# Altium schematic sheet Current_DC.SchDoc: Current DC sense
size A3; Organization: ORGANIZATION; Address1: ADDRESS 1; Address2: ADDRESS 2; Address3: ADDRESS 3; Address4: ADDRESS 4; Revision: 0.0; SheetNumber: 16; SheetTotal: 19; ENG_APP_DATE: --/--/--; DSN_APP_DATE: --/--/--; CHK_APP_DATE: --/--/--
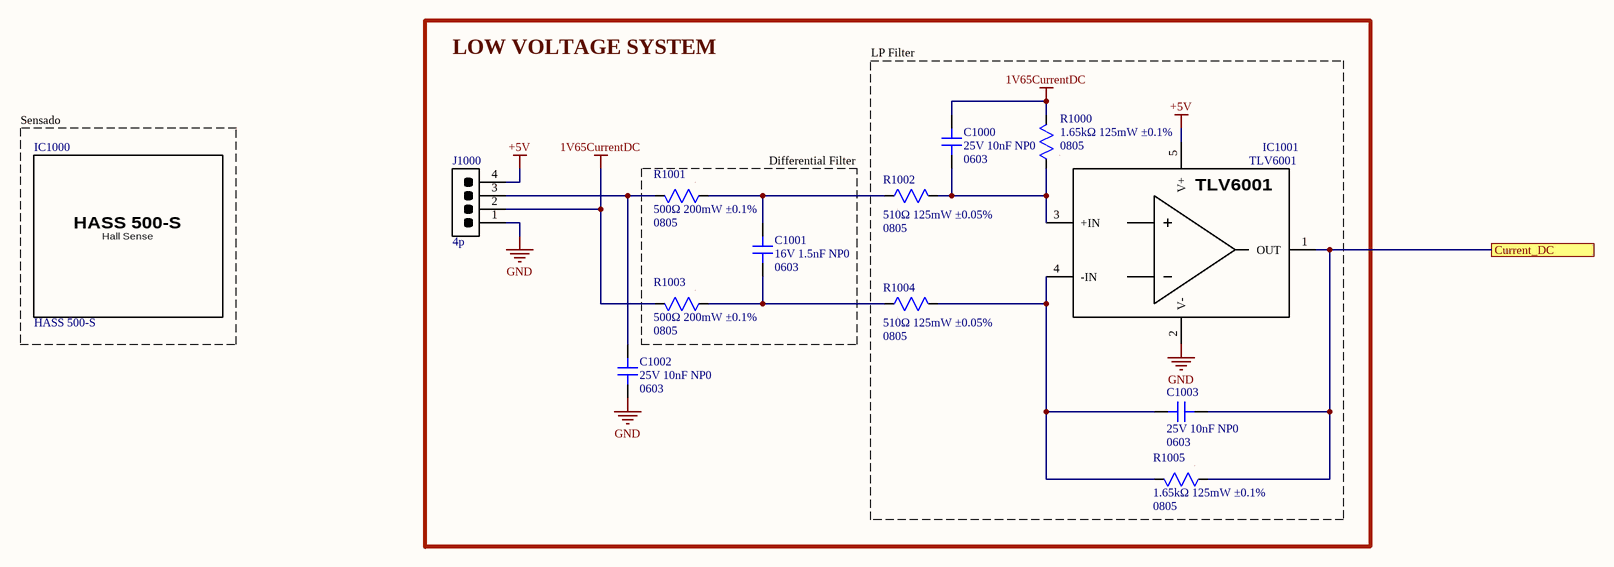
[diagram p0: Current_DC.SchDoc]

## Parts
C1000  value 25V 10nF NP0  Package: 0603  [CAP SMD 0603]  (hidden comment: CAP non polarized)
C1001  value 16V 1.5nF NP0  Package: 0603  [CAP SMD 0603]  (hidden comment: CAP non polarized)
C1002  value 25V 10nF NP0  Package: 0603  [CAP SMD 0603]  (hidden comment: CAP non polarized)
C1003  value 25V 10nF NP0  Package: 0603  [CAP SMD 0603]  (hidden comment: CAP non polarized)
IC1000  HASS 500-S  [HASS 500-S]
IC1001  TLV6001  [SOT-23-5]
J1000  value 4p  [B4B-XH-A-BK(LF)(SN)]  (hidden comment: CONN 4P)
R1000  value 1.65kΩ 125mW ±0.1%  Package: 0805  [RES SMD 0805]  (hidden comment: RES)
R1001  value 500Ω 200mW ±0.1%  Package: 0805  [RES SMD 0805]  (hidden comment: RES)
R1002  value 510Ω 125mW ±0.05%  Package: 0805  [RES SMD 0805]  (hidden comment: RES)
R1003  value 500Ω 200mW ±0.1%  Package: 0805  [RES SMD 0805]  (hidden comment: RES)
R1004  value 510Ω 125mW ±0.05%  Package: 0805  [RES SMD 0805]  (hidden comment: RES)
R1005  value 1.65kΩ 125mW ±0.1%  Package: 0805  [RES SMD 0805]  (hidden comment: RES)

## Blocks framed on the sheet
LOW VOLTAGE SYSTEM: C1002 J1000
LP Filter: C1000 C1003 IC1001 R1000 R1002 R1004 R1005
Sensado: IC1000
Differential Filter: C1001 R1001 R1003

## Ports
Current_DC

## Nets
1V65CurrentDC: C1000.1 J1000.2 R1000.2 R1003.2
+5V: IC1001.5(V+) J1000.4
GND: C1002.2 IC1001.2(V-) J1000.1
Current_DC: C1003.2 IC1001.1(OUT) R1005.1 ; port Current_DC
NetC1000_2: C1000.2 IC1001.3(+IN) R1000.1 R1002.2
NetC1001_1: C1001.1 R1001.1 R1002.1
NetC1001_2: C1001.2 R1003.1 R1004.1
NetC1002_1: C1002.1 J1000.3 R1001.2
NetC1003_1: C1003.1 IC1001.4(-IN) R1004.2 R1005.2

## Notes on the sheet
- Project:
- Subsystem:
- Company:
- Document:
- Author:
- Revision:
- Date:
- Sheet:
- /
- (in symbol 060-0003) Hall Sense

## Library data of the parts
C1000 C1002 C1003 = 001-0107: Condensadores de cerámica multicapa (MLCC- SMD/SMT) 0.01 uF 25 VDC 1% 0603 C0G (NP0) AEC-Q200; MPN: GRT1885C1E103FA02D; Manufacturer: muRata; ComponentLink1Description: Datasheet; ComponentLink1URL: https://www.mouser.es/datasheet/3/76/2/GRT1885C1E103FA02_01A.pdf; ComponentLink2Description: Distributor Link; ComponentLink2URL: https://www.mouser.es/ProductDetail/Murata-Electronics/GRT1885C1E103FA02D?qs=xZ%2FP%252Ba9zWqaqiXqJj78%252Bmg%3D%3D; ID: 001-0107; Distributor PN: 81-GRT1885C1E103FA2D; Distributor: Mouser
C1001 = 001-0121: Condensadores de cerámica multicapa (MLCC- SMD/SMT) 25V 1500pF C0G 0603 1%; MPN: C0603C152F3GECTU; Manufacturer: KEMET; ComponentLink1Description: Datasheet; ComponentLink1URL: https://www.mouser.es/datasheet/3/508/1/KEM_C1091_C0G_ESD.pdf; ComponentLink2Description: Distributor Link; ComponentLink2URL: https://www.mouser.es/ProductDetail/KEMET/C0603C152F3GECTU?qs=Mv7BduZupUh%252Bk5D8ZWarTg%3D%3D; ID: 001-0121; Distributor PN: 80-C0603C152F3GEC; Distributor: Mouser
IC1000 = 060-0003: Sensores de corriente montados en placa; Manufacturer: LEM; Value: 500A; ComponentLink1Description: Datasheet; ComponentLink1URL: https://www.lem.com/sites/default/files/products_datasheets/hass-50_600-s-v22.pdf; ComponentLink2Description: Distributor Link; ComponentLink2URL: https://www.mouser.es/ProductDetail/LEM/HASS-500-S?qs=Vi0JKjFBtYkICNHwIPcpdw%3D%3D; ID: 060-0003; Package: -; MPN: HASS 500-S; Distributor PN: 61-HASS500-S; Distributor: Mouser
IC1001 = 062-0002: Amplificadores operacionales - Op Amps Single 5.5-V 1-MHz R RIO operational a A A 595-TLV6001UIDBVT; MPN: TLV6001UIDBVR; Manufacturer: Texas Instruments; ID: 062-0002; Value: -; Package: SOT-23-5; Distributor PN: 595-TLV6001UIDBVR; Distributor: Mouser; ComponentLink1URL: https://www.ti.com/lit/ds/symlink/tlv6001.pdf?ts=1781607824916&ref_url=https%253A%252F%252Fcz.mouser.com%252F; ComponentLink2URL: https://www.mouser.es/ProductDetail/Texas-Instruments/TLV6001UIDBVR?qs=8N88piwwHEgntIgM8jjJ5Q%3D%3D
J1000 = 110-0068: Alojamientos de cables y cabecera XH HEADER (TOP); Manufacturer: JST; ComponentLink1Description: Datasheet; ComponentLink1URL: https://www.mouser.es/datasheet/3/1070/1/eXH.pdf; ComponentLink2Description: Distributor Link; ComponentLink2URL: https://www.mouser.es/ProductDetail/JST-Commercial/B4B-XH-A-BKLFSN?qs=cIziFXvMxOXLG2L7xSRqLw%3D%3D; ID: 110-0068; Package: THT 2,5mm; MPN: B4B-XH-A-BK(LF)(SN); Distributor PN: 306-B4BXHABKLFSN; Distributor: Mouser
R1000 R1005 = 010-0153: Thin Film Resistors MCU 0805-15 0.1% P1 1K65; MPN: MCU08050E1651BP100; Manufacturer: Vishay; ComponentLink1Description: Datasheet; ComponentLink1URL: https://www.vishay.com/docs/28700/mcx0x0xpre.pdf; ComponentLink2Description: Distributor Link; ComponentLink2URL: https://www.mouser.es/ProductDetail/Vishay-Beyschlag/MCU08050E1651BP100?qs=sGAEpiMZZMvdGkrng054t2c0lhweLxbk6HRvs42FTBI%3D; ID: 010-0153; Distributor PN: 594-MCU08050E1651BP1; Distributor: Mouser
R1001 R1003 = 010-0178: Resistores de película fina - SMD 0.2W 500ohm 0.1% 10ppm; MPN: PTN0805Y5000BST1; Manufacturer: Vishay; ComponentLink1Description: Datasheet; ComponentLink1URL: https://www.vishay.com/docs/60026/ptn.pdf; ComponentLink2Description: Distributor Link; ComponentLink2URL: https://www.mouser.es/ProductDetail/Vishay-Thin-Film/PTN0805Y5000BST1?qs=zW32dvEIR3sKd%2FnwncGe3A%3D%3D; ID: 010-0178; Distributor PN: 71-PTN0805Y5000BST1; Distributor: Mouser
R1002 R1004 = 010-0179: Resistores de película fina - SMD 1/8W 510 Ohms 0.05% 0805 10ppm; MPN: RG2012N-511-W-T1; Manufacturer: Susumu; ComponentLink1Description: Datasheet; ComponentLink1URL: https://www.mouser.es/datasheet/3/826/1/n_catalog_partition01_en.pdf; ComponentLink2Description: Distributor Link; ComponentLink2URL: https://www.mouser.es/ProductDetail/Susumu/RG2012N-511-W-T1?qs=juJhw1yPxAFbuvw1oDA4sg%3D%3D; ID: 010-0179; Distributor PN: 754-RG2012N-511-W-T1; Distributor: Mouser